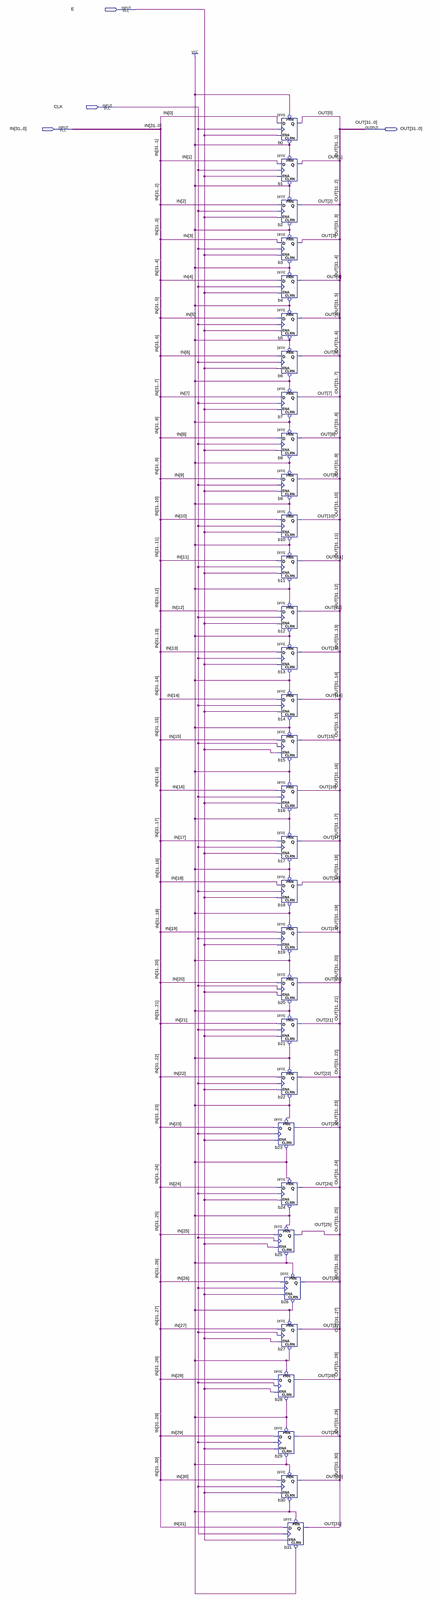
[diagram p0: schematic sheet, whole]
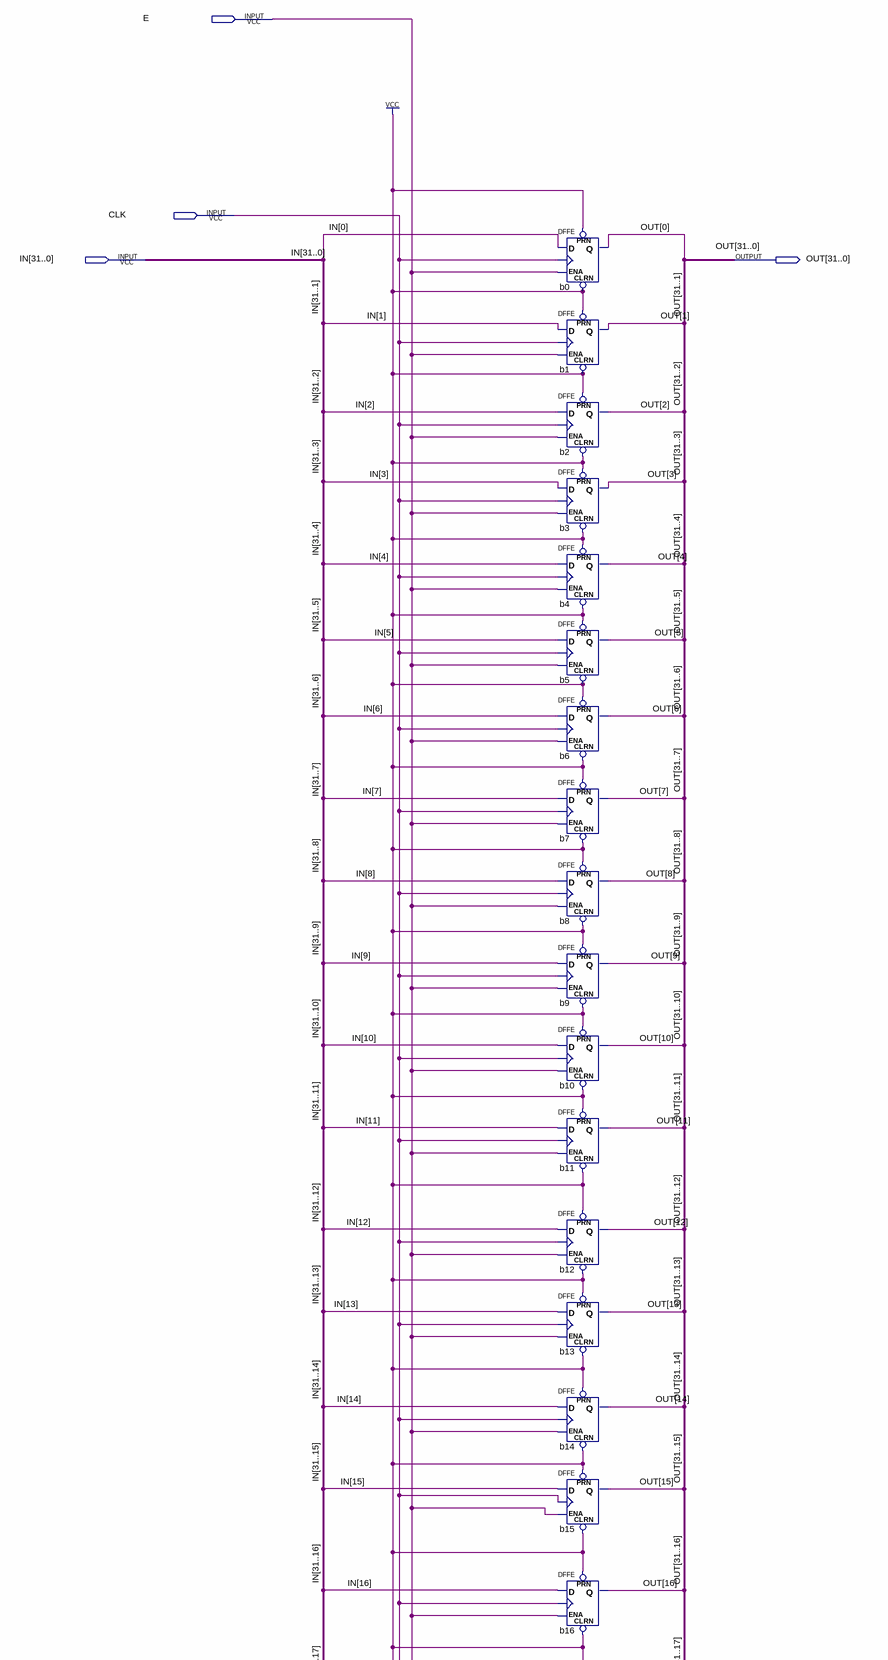
[diagram p1: schematic sheet, upper part]
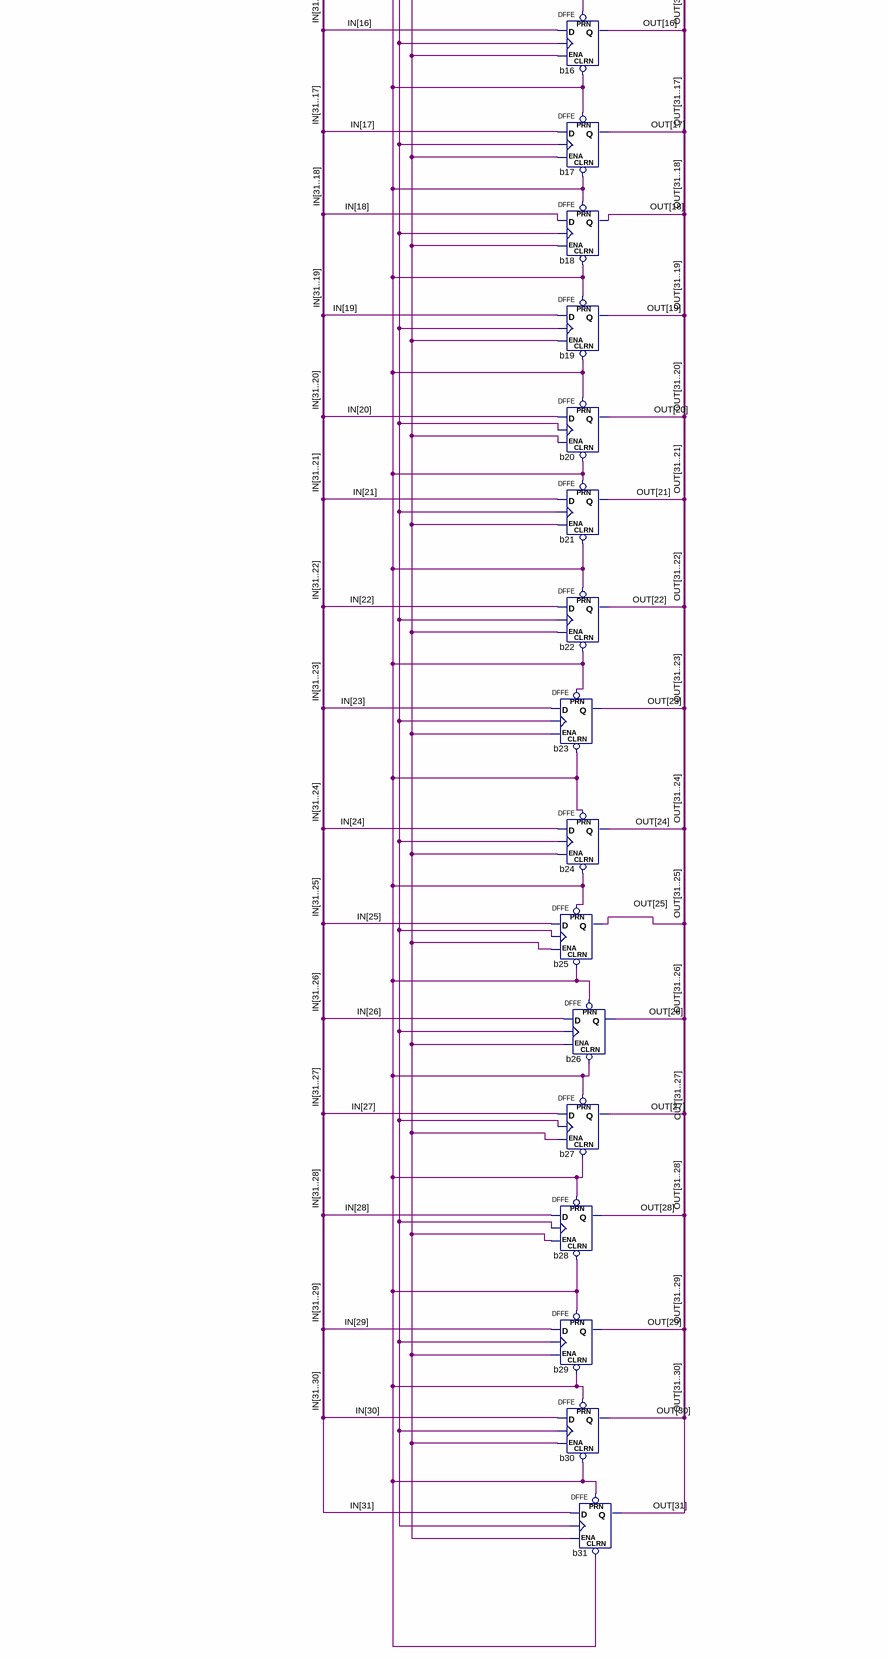
[diagram p2: schematic sheet, lower part]
// Quartus schematic reg32.bdf as structural Verilog: 32 symbols, 4 pins
module reg32 (
  input  E,
  input  CLK,
  input  [31:0] IN,
  output [31:0] OUT
);

  DFFE b0 (.PRN(1'b1), .CLRN(1'b1), .D(IN[0]), .CLK(CLK), .ENA(E), .Q(OUT[0]));
  DFFE b1 (.PRN(1'b1), .CLRN(1'b1), .D(IN[1]), .CLK(CLK), .ENA(E), .Q(OUT[1]));
  DFFE b2 (.PRN(1'b1), .CLRN(1'b1), .D(IN[2]), .CLK(CLK), .ENA(E), .Q(OUT[2]));
  DFFE b3 (.PRN(1'b1), .CLRN(1'b1), .D(IN[3]), .CLK(CLK), .ENA(E), .Q(OUT[3]));
  DFFE b4 (.PRN(1'b1), .CLRN(1'b1), .D(IN[4]), .CLK(CLK), .ENA(E), .Q(OUT[4]));
  DFFE b5 (.PRN(1'b1), .CLRN(1'b1), .D(IN[5]), .CLK(CLK), .ENA(E), .Q(OUT[5]));
  DFFE b6 (.PRN(1'b1), .CLRN(1'b1), .D(IN[6]), .CLK(CLK), .ENA(E), .Q(OUT[6]));
  DFFE b7 (.PRN(1'b1), .CLRN(1'b1), .D(IN[7]), .CLK(CLK), .ENA(E), .Q(OUT[7]));
  DFFE b8 (.PRN(1'b1), .CLRN(1'b1), .D(IN[8]), .CLK(CLK), .ENA(E), .Q(OUT[8]));
  DFFE b9 (.PRN(1'b1), .CLRN(1'b1), .D(IN[9]), .CLK(CLK), .ENA(E), .Q(OUT[9]));
  DFFE b10 (.PRN(1'b1), .CLRN(1'b1), .D(IN[10]), .CLK(CLK), .ENA(E), .Q(OUT[10]));
  DFFE b11 (.PRN(1'b1), .CLRN(1'b1), .D(IN[11]), .CLK(CLK), .ENA(E), .Q(OUT[11]));
  DFFE b12 (.PRN(1'b1), .CLRN(1'b1), .D(IN[12]), .CLK(CLK), .ENA(E), .Q(OUT[12]));
  DFFE b13 (.PRN(1'b1), .CLRN(1'b1), .D(IN[13]), .CLK(CLK), .ENA(E), .Q(OUT[13]));
  DFFE b14 (.PRN(1'b1), .CLRN(1'b1), .D(IN[14]), .CLK(CLK), .ENA(E), .Q(OUT[14]));
  DFFE b15 (.PRN(1'b1), .CLRN(1'b1), .D(IN[15]), .CLK(CLK), .ENA(E), .Q(OUT[15]));
  DFFE b16 (.PRN(1'b1), .CLRN(1'b1), .D(IN[16]), .CLK(CLK), .ENA(E), .Q(OUT[16]));
  DFFE b17 (.PRN(1'b1), .CLRN(1'b1), .D(IN[17]), .CLK(CLK), .ENA(E), .Q(OUT[17]));
  DFFE b18 (.PRN(1'b1), .CLRN(1'b1), .D(IN[18]), .CLK(CLK), .ENA(E), .Q(OUT[18]));
  DFFE b19 (.PRN(1'b1), .CLRN(1'b1), .D(IN[19]), .CLK(CLK), .ENA(E), .Q(OUT[19]));
  DFFE b20 (.PRN(1'b1), .CLRN(1'b1), .D(IN[20]), .CLK(CLK), .ENA(E), .Q(OUT[20]));
  DFFE b21 (.PRN(1'b1), .CLRN(1'b1), .D(IN[21]), .CLK(CLK), .ENA(E), .Q(OUT[21]));
  DFFE b22 (.PRN(1'b1), .CLRN(1'b1), .D(IN[22]), .CLK(CLK), .ENA(E), .Q(OUT[22]));
  DFFE b23 (.PRN(1'b1), .CLRN(1'b1), .D(IN[23]), .CLK(CLK), .ENA(E), .Q(OUT[23]));
  DFFE b24 (.PRN(1'b1), .CLRN(1'b1), .D(IN[24]), .CLK(CLK), .ENA(E), .Q(OUT[24]));
  DFFE b25 (.PRN(1'b1), .CLRN(1'b1), .D(IN[25]), .CLK(CLK), .ENA(E), .Q(OUT[25]));
  DFFE b26 (.PRN(1'b1), .CLRN(1'b1), .D(IN[26]), .CLK(CLK), .ENA(E), .Q(OUT[26]));
  DFFE b27 (.PRN(1'b1), .CLRN(1'b1), .D(IN[27]), .CLK(CLK), .ENA(E), .Q(OUT[27]));
  DFFE b28 (.PRN(1'b1), .CLRN(1'b1), .D(IN[28]), .CLK(CLK), .ENA(E), .Q(OUT[28]));
  DFFE b29 (.PRN(1'b1), .CLRN(1'b1), .D(IN[29]), .CLK(CLK), .ENA(E), .Q(OUT[29]));
  DFFE b30 (.PRN(1'b1), .CLRN(1'b1), .D(IN[30]), .CLK(CLK), .ENA(E), .Q(OUT[30]));
  DFFE b31 (.PRN(1'b1), .CLRN(1'b1), .D(IN[31]), .CLK(CLK), .ENA(E), .Q(OUT[31]));
endmodule
